# EAGLE design PAMonitorAP2 (EAGLE 7.5.0)
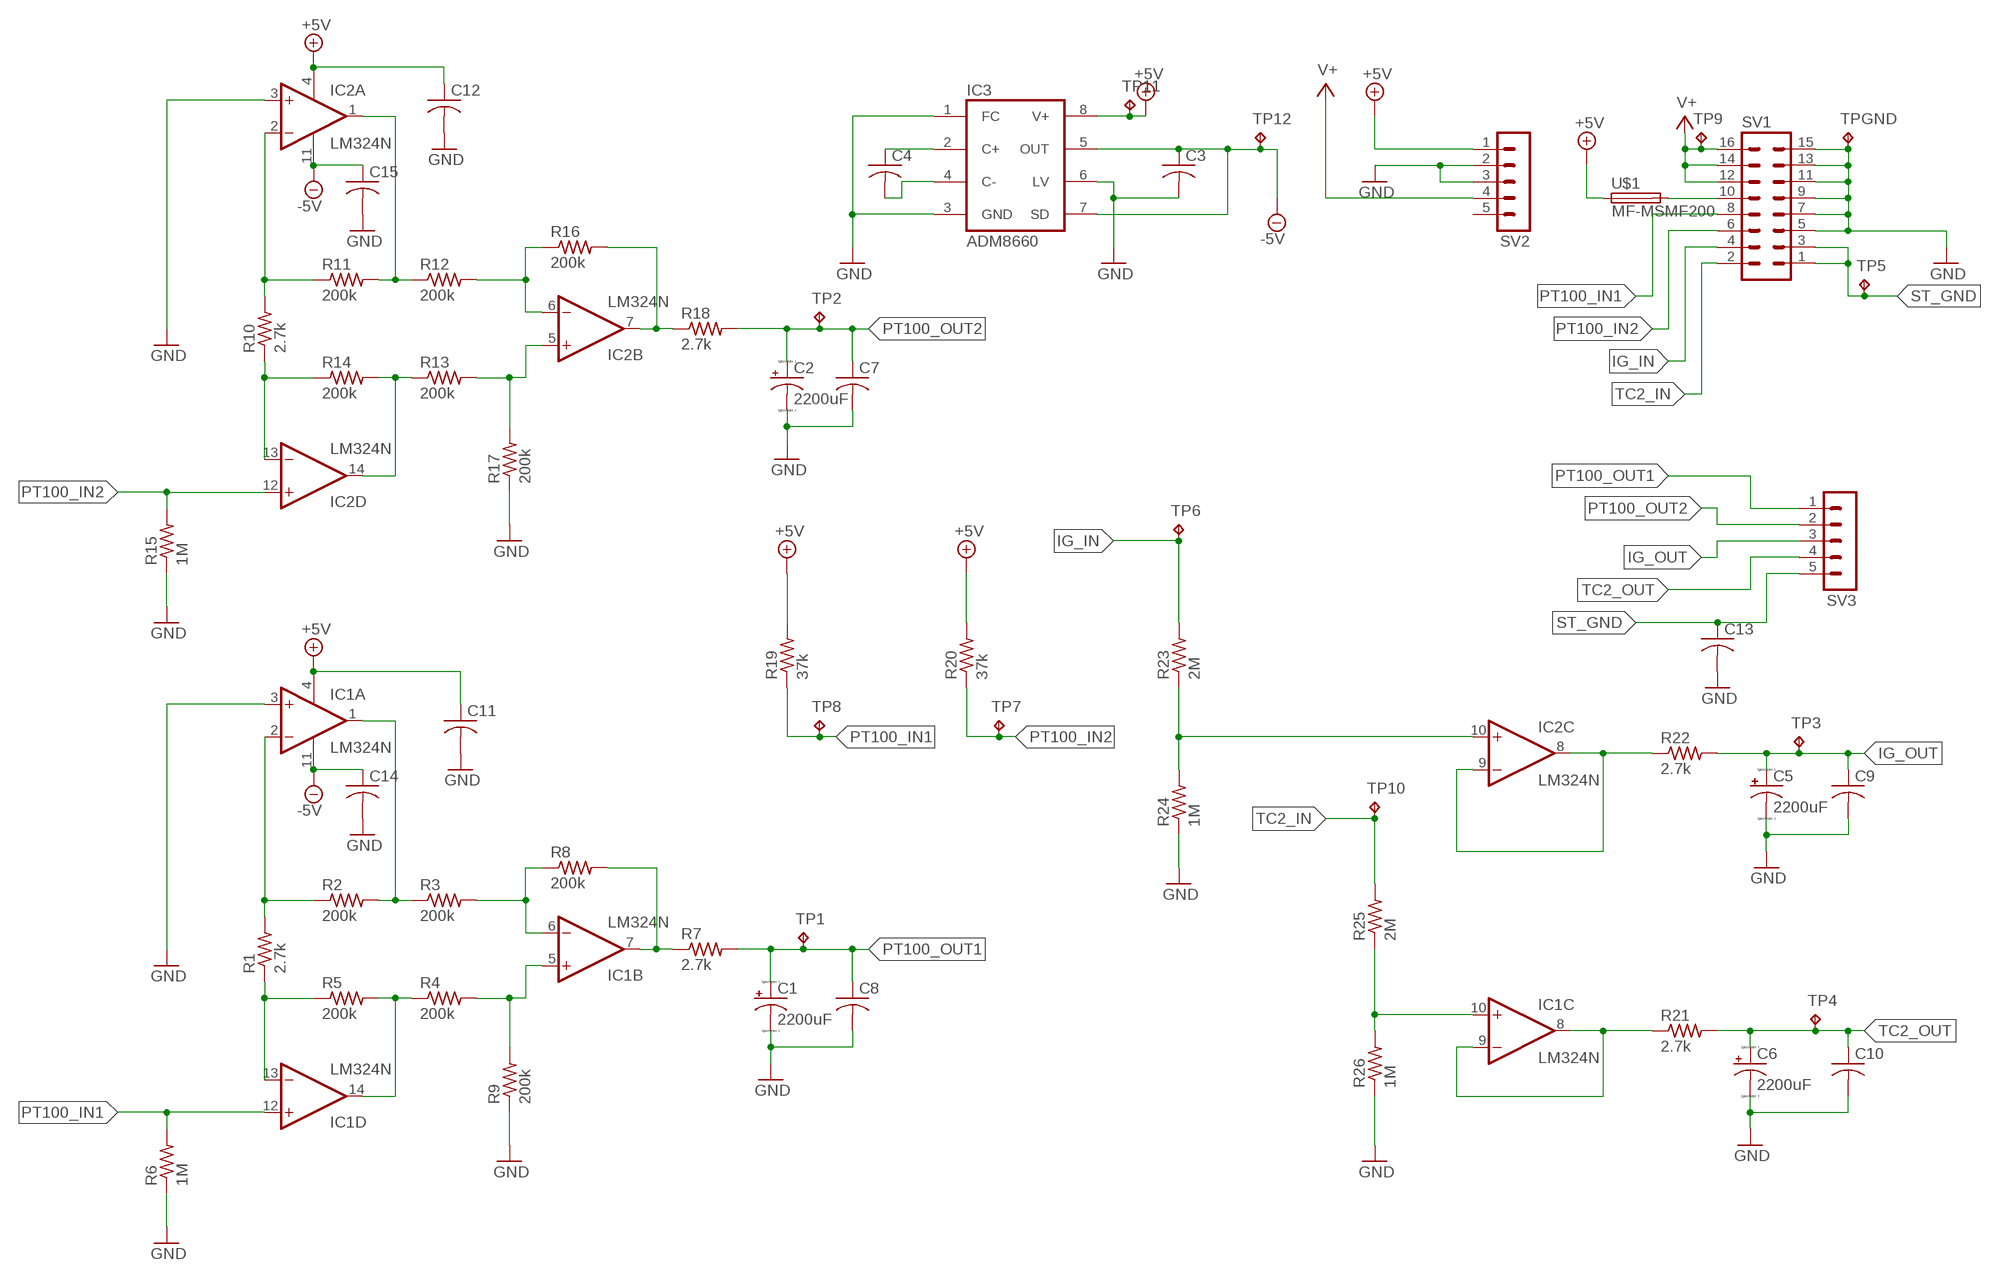
[diagram p0: schematic, sheet 1]

## Parts
C1  2200uF  CPOL-USE5-10.5  [E5-10,5]
C2  2200uF  CPOL-USE5-10.5  [E5-10,5]
C3  C-US025-025X050  [C025-025X050]
C4  C-US025-025X050  [C025-025X050]
C5  2200uF  CPOL-USE5-10.5  [E5-10,5]
C6  2200uF  CPOL-USE5-10.5  [E5-10,5]
C7  C-US025-025X050  [C025-025X050]
C8  C-US025-025X050  [C025-025X050]
C9  C-US025-025X050  [C025-025X050]
C10  C-US025-025X050  [C025-025X050]
C11  C-US025-025X050  [C025-025X050]
C12  C-US025-025X050  [C025-025X050]
C13  C-US025-025X050  [C025-025X050]
C14  C-US025-025X050  [C025-025X050]
C15  C-US025-025X050  [C025-025X050]
IC1  LM324N  [DIL14]
IC2  LM324N  [DIL14]
IC3  ADM8660  [ADM8660-DIL08]
R1  2.7k  R-US_0309/12  [0309/12]
R2  200k  R-US_0309/12  [0309/12]
R3  200k  R-US_0309/12  [0309/12]
R4  200k  R-US_0309/12  [0309/12]
R5  200k  R-US_0309/12  [0309/12]
R6  1M  R-US_0309/12  [0309/12]
R7  2.7k  R-US_0309/12  [0309/12]
R8  200k  R-US_0309/12  [0309/12]
R9  200k  R-US_0309/12  [0309/12]
R10  2.7k  R-US_0309/12  [0309/12]
R11  200k  R-US_0309/12  [0309/12]
R12  200k  R-US_0309/12  [0309/12]
R13  200k  R-US_0309/12  [0309/12]
R14  200k  R-US_0309/12  [0309/12]
R15  1M  R-US_0309/12  [0309/12]
R16  200k  R-US_0309/12  [0309/12]
R17  200k  R-US_0309/12  [0309/12]
R18  2.7k  R-US_0309/12  [0309/12]
R19  37k  R-US_0309/12  [0309/12]
R20  37k  R-US_0309/12  [0309/12]
R21  2.7k  R-US_0309/12  [0309/12]
R22  2.7k  R-US_0309/12  [0309/12]
R23  2M  R-US_0309/12  [0309/12]
R24  1M  R-US_0309/12  [0309/12]
R25  2M  R-US_0309/12  [0309/12]
R26  1M  R-US_0309/12  [0309/12]
SV1  MA08-2  [MA08-2]
SV2  MA05-1  [MA05-1]
SV3  MA05-1  [MA05-1]
TP1  TPB2,54  [B2,54]
TP2  TPB2,54  [B2,54]
TP3  TPB2,54  [B2,54]
TP4  TPB2,54  [B2,54]
TP5  TPB2,54  [B2,54]
TP6  TPB2,54  [B2,54]
TP7  TPB2,54  [B2,54]
TP8  TPB2,54  [B2,54]
TP9  TPB2,54  [B2,54]
TP10  TPB2,54  [B2,54]
TP11  TPB2,54  [B2,54]
TP12  TPB2,54  [B2,54]
TPGND  TPB2,54  [B2,54]
U$1  MF-MSMF200  MF-MSMF050  [MF-MSMF200]

## Nets
+5V: C11.1 C12.1 IC1.4(P:V+) IC2.4(P:V+) IC3.8(V+) R19.2 R20.2 SV2.1 TP11.TP U$1.1
-5V: C3.1 C14.1 C15.1 IC1.11(P:V-) IC2.11(P:V-) IC3.5(OUT) IC3.7(SD) TP12.TP
GND: C1.- C2.- C3.2 C5.- C6.- C7.2 C8.2 C9.2 C10.2 C11.2 C12.2 C13.2 C14.2 C15.2 IC1.3(A:+IN) IC2.3(A:+IN) IC3.1(FC) IC3.3(GND) IC3.6(LV) R6.1 R9.1 R15.1 R17.1 R24.1 R26.1 SV1.5 SV1.7 SV1.9 SV1.11 SV1.13 SV1.15 SV2.2 SV2.3 TPGND.TP
IG_IN: R23.2 SV1.4 TP6.TP
IG_OUT: C5.+ C9.1 R22.2 SV3.3 TP3.TP
N$1: IC1.13(D:-IN) R1.1 R5.1
N$2: IC1.2(A:-IN) R1.2 R2.1
N$3: IC1.1(A:OUT) R2.2 R3.1
N$4: IC1.6(B:-IN) R3.2 R8.1
N$5: IC1.5(B:+IN) R4.2 R9.2
N$6: IC1.14(D:OUT) R4.1 R5.2
N$7: IC1.7(B:OUT) R7.1 R8.2
N$8: IC2.13(D:-IN) R10.1 R14.1
N$9: IC2.2(A:-IN) R10.2 R11.1
N$10: IC2.1(A:OUT) R11.2 R12.1
N$11: IC2.6(B:-IN) R12.2 R16.1
N$12: IC2.5(B:+IN) R13.2 R17.2
N$13: IC2.14(D:OUT) R13.1 R14.2
N$14: IC2.7(B:OUT) R16.2 R18.1
N$15: C4.1 IC3.2(C+)
N$16: C4.2 IC3.4(C-)
N$17: SV1.10 U$1.2
N$18: IC2.8(C:OUT) IC2.9(C:-IN) R22.1
N$19: IC1.8(C:OUT) IC1.9(C:-IN) R21.1
N$20: IC1.10(C:+IN) R25.1 R26.2
N$21: IC2.10(C:+IN) R23.1 R24.2
PT100_IN1: IC1.12(D:+IN) R6.2 R19.1 SV1.8 TP8.TP
PT100_IN2: IC2.12(D:+IN) R15.2 R20.1 SV1.6 TP7.TP
PT100_OUT1: C1.+ C8.1 R7.2 SV3.1 TP1.TP
PT100_OUT2: C2.+ C7.1 R18.2 SV3.2 TP2.TP
ST_GND: C13.1 SV1.1 SV1.3 SV3.5 TP5.TP
TC2_IN: R25.2 SV1.2 TP10.TP
TC2_OUT: C6.+ C10.1 R21.2 SV3.4 TP4.TP
V+: SV1.12 SV1.14 SV1.16 SV2.4 TP9.TP
Unconnected: SV2.5

## Library data of the parts
C1 C2 C5 C6 = resistor:CPOL-US: POLARIZED CAPACITOR, American symbol
C3 C4 C7-C15 = rcl:C-US: CAPACITOR, American symbol
IC1 IC2 = linear:LM324: OP AMP
IC3 = my-comps:ADM8660: Charge-pump VOLTAGE CONVERTER; MF: Analog Devices; MPN: ADM8660
R1-R26 = resistor:R-US_: RESISTOR, American symbol
SV1 = con-lstb:MA08-2: PIN HEADER; OC_FARNELL: unknown; OC_NEWARK: unknown
SV2 SV3 = con-lstb:MA05-1: PIN HEADER; OC_FARNELL: unknown; OC_NEWARK: unknown
TP1-TP12 TPGND = testpad:TP: Test pad
U$1 = my-comps:MF-MSMF: MF-MSMF Series - PTC Resettable Fuses

## Board
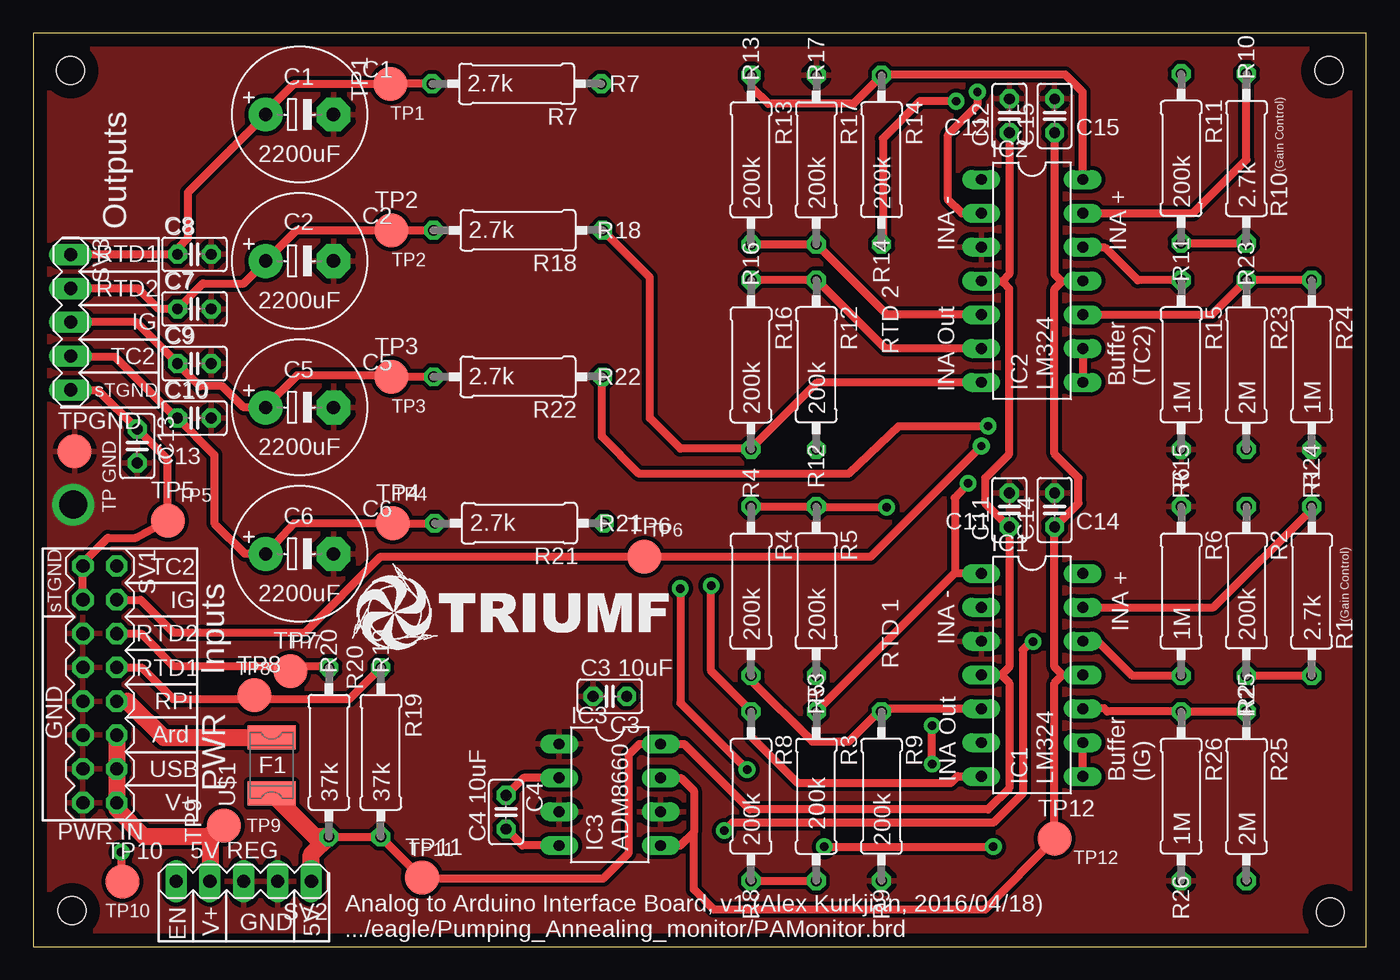
[diagram p1: board, top side]
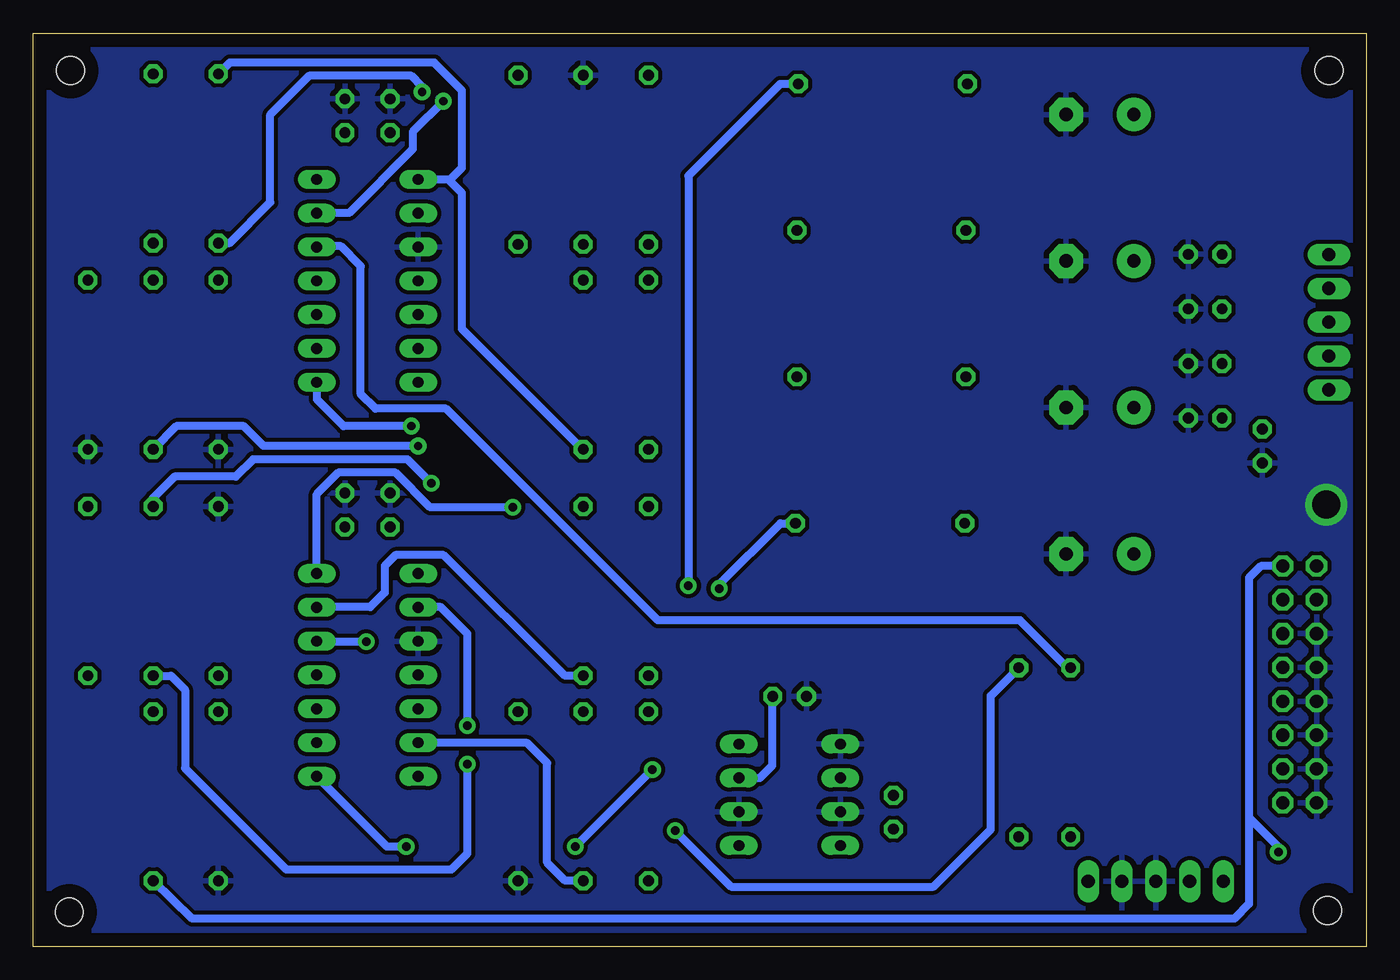
[diagram p2: board, bottom side, seen from below]

Size 100.1 x 68.6 mm. Coordinates in mm from the lower left corner, seen from the top.
Outline: 0,0 100.1,0 100.1,68.6 0,68.6 0,0
Copper layers (1*16): Top 0.035mm / dielectric 1.5mm / Bottom 0.035mm
Design rules "default *": minimum track width 24mil, minimum drill 25mil, track to track 12mil, track to pad 12mil, pad to pad 12mil, via to via 12mil, smd to smd 12mil, copper to edge 40mil, drill to drill 16mil, minimum pad ring 12mil, minimum via ring 12mil, stop-mask expansion 4mil, vias tented up to drill 10mil, thermal gap 16mil
Holes 2.11 mm at 2.9,2.7 97.4,2.6 97.3,65.8 2.8,65.8

### Footprints (pad centres in the part's own frame; a part is rotated, then mirrored left to right if it is on the bottom)
E5-10,5 = drill 0.991 pad 2.54: + -2.54,0 | drill 0.991 pad 2.54 octagon: - 2.54,0
C025-025X050 = drill 0.813 octagon: 1 -1.27,0; 2 1.27,0
DIL14 = drill 0.813 long: 1 -7.62,-3.81; 2 -5.08,-3.81; 3 -2.54,-3.81; 4 0,-3.81; 5 2.54,-3.81; 6 5.08,-3.81; 7 7.62,-3.81; 8 7.62,3.81; 9 5.08,3.81; 10 2.54,3.81; 11 0,3.81; 12 -2.54,3.81; 13 -5.08,3.81; 14 -7.62,3.81
ADM8660-DIL08 = drill 0.813 long: 1 -3.81,-3.81; 2 -1.27,-3.81; 3 1.27,-3.81; 4 3.81,-3.81; 5 3.81,3.81; 6 1.27,3.81; 7 -1.27,3.81; 8 -3.81,3.81
0309/12 = drill 0.813 octagon: 1 -6.35,0; 2 6.35,0
MA08-2 = drill 0.991 octagon: 1 -8.89,-1.27; 2 -8.89,1.27; 3 -6.35,-1.27; 4 -6.35,1.27; 5 -3.81,-1.27; 6 -3.81,1.27; 7 -1.27,-1.27; 8 -1.27,1.27; 9 1.27,-1.27; 10 1.27,1.27; 11 3.81,-1.27; 12 3.81,1.27; 13 6.35,-1.27; 14 6.35,1.27; 15 8.89,-1.27; 16 8.89,1.27
MA05-1 = drill 0.991 long: 1 -5.08,0; 2 -2.54,0; 3 0,0; 4 2.54,0; 5 5.08,0
B2,54 = smd 2.54 x 2.54: TP 0,0
MF-MSMF200 = smd 1.8 x 3.6: 1 -2.1,0; 2 2.1,0

### Placement (x,y rotation side)
C1  20,62.5 0 top
C2  20,51.5 0 top
C3  43.3,18.8 180 top
C4  35.5,10.1 270 top
C5  20,40.5 0 top
C6  20,29.5 0 top
C7  12.1,47.9 0 top
C8  12.1,52 0 top
C9  12.1,43.8 0 top
C10  12.1,39.7 0 top
C11  73.3,32.8 90 top
C12  73.3,62.4 90 top
C13  7.8,37.6 270 top
C14  76.7,32.8 90 top
C15  76.7,62.4 90 top
IC1  75,20.4 270 top
IC2  75,50 270 top
IC3  43.3,11.4 270 top
R1  96,26.7 270 top
R2  91.1,26.7 90 top
R3  58.8,11.3 270 top
R4  53.9,26.7 270 top
R5  58.8,26.7 90 top
R6  86.2,26.7 270 top
R7  36.3,64.8 180 top
R8  53.9,11.3 90 top
R9  63.7,11.3 90 top
R10  91.1,59.2 270 top
R11  86.2,59.2 90 top
R12  58.8,43.7 90 top
R13  53.9,59.1 270 top
R14  63.7,59.1 90 top
R15  86.2,43.7 90 top
R16  53.9,43.7 270 top
R17  58.8,59.1 270 top
R18  36.4,53.8 180 top
R19  26.1,14.6 270 top
R20  22.2,14.6 270 top
R21  36.5,31.8 180 top
R22  36.4,42.8 180 top
R23  91.1,43.7 270 top
R24  96,43.7 90 top
R25  91.1,11.3 270 top
R26  86.2,11.3 90 top
SV1  5,19.7 270 top
SV2  15.8,4.9 180 top
SV3  2.8,46.9 270 top
TP1  26.8,64.8 90 top
TP2  26.9,53.8 0 top
TP3  26.9,42.8 0 top
TP4  27,31.8 0 top
TP5  10.1,32 0 top
TP6  45.9,29.3 0 top
TP7  19.3,20.7 0 top
TP8  16.6,18.9 0 top
TP9  14.3,9.1 90 top
TP10  6.7,4.9 0 top
TP11  29.2,5.2 0 top
TP12  76.7,8.1 0 top
TPGND  3.1,37.2 0 top
U$1  17.9,13.6 90 top

### Tracks (layer width: path | path; a pad name or v marks a point on that pad's centre or on a via)
+5V
  Top 0.61: R20.2 R19.2 29.25,5.1 | IC3.8 48.9,15.2 53.8,10.3 71.7,10.3 73.3,11.9 73.3,19.8 72.7,20.4 | IC3.8 | IC3.8 45.5,15.2 44.7,14.4 44.7,7 42.8,5.1 29.25,5.1 | C11.1 73.3,21 72.7,20.4 | C12.1 73.3,50.5 72.8,50 | IC2.4 72.8,50 | 72.8,50 72.8,49.9 73.3,49.4 73.3,37 71.5,35.2 71.5,33.3 73.27,31.53 C11.1 | IC1.4 72.7,20.4 | 73.3,31.47 C11.1 | 29.25,5.1 29.25,5.15 TP11.TP
  Top 1.27: SV2.1 20.88,6.93 R20.2 21.15,8.25 U$1.1
-5V
  Top 0.61: IC3.7 48.63,12.67 49.6,11.7 49.6,8.6 | 49.6,8.6 48.6,7.6 IC3.5 | 49.6,8.6 49.6,4.3 51.1,2.8 71.5,2.8 TP12.TP 76.7,19.8 77.3,20.4 | 77.3,20.4 76.7,21 C14.1 76.73,31.53 78.5,33.3 78.5,35.2 76.7,37 76.7,49.4 77.2,49.9 77.2,50 | 77.3,20.4 IC1.11 | 77.2,50 76.7,50.5 C15.1 | 77.2,50 IC2.11
  Bottom 0.61: IC3.7 45.53,12.67 44.6,13.6 44.6,18.77 C3.1
GND  (via drill 2.11 pad 2.11)
  other vias: 3,33.2
  pour Bottom: -0.6,71.7 102.2,71.7 102.2,-1.1 -0.6,-1.1
  pour Top: -2.5,72.6 105.9,72.6 105.9,-2.8 -2.5,-2.8
IG_IN  (via drill 0.64 pad 0.64)
  Top 0.61: SV1.4 8.05,26.05 10.5,23.6 20.4,23.6 26.1,29.3 TP6.TP | TP6.TP 62.9,29.3 v71.2,37.6 | TP6.TP 62.9,29.3 63.15,29.55
  Bottom 0.61: v71.2,37.6 82.8,37.6 84.3,39.1 89.35,39.1 R23.2
IG_OUT
  Top 0.61: R22.2 TP3.TP 26.8,42.9 19.8,42.9 17.46,40.56 | 17.46,40.56 C5.+ | 17.46,40.56 17.4,40.5 15.8,40.5 14.2,42.1 12.5,42.1 10.83,43.77 C9.1 7.73,46.9 SV3.3
N$1
  Top 0.61: IC1.13 88.63,25.48 96,32.85 R1.1
  Bottom 0.61: R5.1 60.15,20.35 69.3,29.4 72.9,29.4 73.7,28.6 73.7,26.6 74.8,25.5 78.79,25.5 IC1.13
N$2  (via drill 0.64 pad 0.64)
  Top 0.61: R1.2 R2.1 | v67.5,13.7 v67.5,16.6
  Bottom 0.61: R2.1 89.75,20.35 88.7,19.3 88.7,13.4 81.1,5.8 68.7,5.8 67.5,7 v67.5,13.7 | v67.5,16.6 67.5,23.5 69.5,25.5 71.17,25.5 IC1.2
N$3  (via drill 0.64 pad 0.64)
  Top 0.61: 69.17,28.02 IC1.1 | 69.17,28.02 R3.1 | v70.2,34.8 69.2,33.7 69.2,28.05 69.17,28.02
  Bottom 0.61: R2.2 91.1,33.7 89.5,35.3 84.9,35.3 83.6,36.6 72,36.6 v70.2,34.8
N$4
  Top 0.61: R8.1 R3.2
  Bottom 0.61: R3.2 60.15,4.95 61.5,6.3 61.5,13.8 63,15.3 71.17,15.3 IC1.6
N$5
  Top 0.61: R4.2 53.9,20 58.5,15.4 61.25,15.4 63.5,17.65 R9.2 63.7,17.86 IC1.5
N$6  (via drill 0.64 pad 0.64)
  Top 0.61: R4.1 R5.2 58.85,33 v64.1,33
  Bottom 0.61: v64.1,33 70.3,33 72.9,35.6 77.2,35.6 78.81,33.99 IC1.14
N$7  (via drill 0.64 pad 0.64)
  Top 0.61: v50.9,27.1 50.9,20.7 53.9,17.7 R8.2 53.9,15.8 57.4,12.3 68.9,12.3 69.4,12.8 71.17,12.8 IC1.7
  Bottom 0.61: v50.9,27.1 50.9,57.9 44,64.8 R7.1
N$8  (via drill 0.64 pad 0.64)
  Top 0.61: IC2.13 87.08,55.08 91.1,59.1 R10.1 | v69.3,63.5 66.6,63.5 63.8,60.7 63.8,52.85 R14.1
  Bottom 0.61: IC2.13 78.22,55.08 78.2,55.1 76.4,55.1 71.6,59.9 71.6,61.2 v69.3,63.5 | v69.3,63.5 69.6,63.7 69.5,63.7 v69.3,63.5
N$9  (via drill 0.64 pad 0.64)
  Top 0.61: R11.1 R10.2 | IC2.2 69.72,55.08 68.7,56.1 68.7,61 70.9,63.2 v70.9,64.2
  Bottom 0.61: R11.1 85.35,52.85 82.3,55.9 82.3,62.5 79.4,65.4 71.7,65.4 70.9,64.6 v70.9,64.2
N$10
  Bottom 0.61: R12.1 58.85,37.35 67.9,46.4 67.9,56.6 68.9,57.6 | 68.9,57.6 71.17,57.6 IC2.1 | 68.9,57.6 68.8,57.6 67.9,58.5 67.9,64.3 70,66.4 85.35,66.4 R11.2
N$11
  Top 0.61: R16.1 R12.2 58.85,50.05 63.98,44.92 IC2.6
N$12
  Top 0.61: R13.2 R17.2 64.09,47.46 IC2.5
N$13
  Top 0.61: R13.1 53.9,64.6 55.2,63.3 61.6,63.3 63.7,65.4 R14.2 63.75,65.5 77.5,65.5 78.81,64.19 IC2.14
N$14
  Top 0.61: R16.2 53.9,37.4 | IC2.7 71.17,42.4 58.9,42.4 53.9,37.4 | 53.9,37.4 48.6,37.4 46.3,39.7 46.3,50.25 R18.1
N$15
  Top 0.61: IC3.2 36.8,12.67 C4.1
N$16
  Top 0.61: IC3.4 36.74,7.59 C4.2
N$17
  Top 1.27: SV1.10 7.07,18.43 9.8,15.7 U$1.2
N$18  (via drill 0.64 pad 0.64)
  Top 0.61: IC2.9 IC2.8 | v71.7,39.1 65,39.1 61.2,35.5 45.5,35.5 42.7,38.3 42.7,42.75 R22.1
  Bottom 0.61: v71.7,39.1 76.8,39.1 78.8,41.1 IC2.8
N$19  (via drill 0.64 pad 0.61, 0.64 pad 0.64)
  Top 0.61: IC1.8 IC1.9 | v48.6,26.9 48.6,18.3 v53.6,13.3 | v59.4,7.5 v72.1,7.5
  Bottom 0.61: v53.6,13.3 v59.4,7.5 | v72.1,7.5 73.53,7.5 IC1.8 | v48.6,26.9 48.6,27.2 44,31.8 R21.1
N$20
  Top 0.61: IC1.10 78.85,17.9 80.4,17.9 80.65,17.65 R26.2 R25.1
N$21
  Top 0.61: R24.2 R23.1 88.51,47.46 IC2.10
PT100_IN1  (via drill 0.64 pad 0.64)
  Top 0.61: R6.2 82.55,20.35 80,22.9 78.85,22.9 IC1.12 | SV1.8 8.13,20.97 10.5,18.6 16.7,18.6 | 16.7,18.6 23.75,18.6 R19.1 | v75.1,22.9 74.9,22.9 74.3,22.3 74.3,11.5 72.1,9.3 52.5,9.3 v51.9,8.7 | TP8.TP 16.6,18.7 16.7,18.6
  Bottom 0.61: IC1.12 75.14,22.94 v75.1,22.9 | v51.9,8.7 47.7,4.5 32.5,4.5 28.2,8.8 28.2,18.85 R19.1
PT100_IN2
  Top 0.61: SV1.6 8.09,23.51 10.5,21.1 20,21.1 | 22.15,21 R20.1 22.05,21.1 20,21.1 | TP7.TP 19.6,20.7 20,21.1 | R15.2 82.95,50.05 80.5,52.5 78.85,52.5 IC2.12
  Bottom 0.61: R20.1 22.45,20.95 26,24.5 53.2,24.5 69.1,40.4 74.4,40.4 75.5,41.5 75.5,51.1 77,52.6 78.75,52.6 IC2.12
PT100_OUT1
  Top 0.61: R7.2 TP1.TP 19.6,64.8 17.46,62.66 C1.+ 11.6,56.64 11.6,53.2 10.83,52.43 C8.1 10.81,51.98 SV3.1
PT100_OUT2
  Top 0.61: R18.2 TP2.TP 19.76,53.8 C2.+ 17.46,51.46 15.8,49.8 12.73,49.8 C7.1 9.4,47.9 7.86,49.44 SV3.2
ST_GND
  Top 0.61: SV1.3 SV1.1 3.73,28.83 5.6,30.7 7.7,30.7 TP5.TP 10.1,36.57 C13.1 4.85,41.82 SV3.5
TC2_IN  (via drill 0.64 pad 0.64)
  Top 0.61: v6.6,7.1 6.6,5.9 7.5,5 TP10.TP
  Bottom 0.61: SV1.2 7.91,28.59 8.8,27.7 8.8,9.7 | 8.8,9.7 8.8,3.2 9.9,2.1 88.15,2.1 R25.2 | v6.6,7.1 6.6,7.5 8.8,9.7
TC2_OUT
  Top 0.61: R21.2 TP4.TP 19.56,31.8 C6.+ 15.9,29.5 13.6,31.8 13.6,36.93 C10.1 10.73,39.7 6.13,44.3 2.86,44.3 SV3.4
V+
  Top 0.61: SV1.16 6.27,10.43 | TP9.TP 13.9,8.2 13.3,7.6
  Top 1.27: SV1.12 SV1.14 SV1.16 | 6.27,10.43 6.27,10.33 8.3,8.3 13.1,8.3 TP9.TP | 13.3,7.6 13.3,4.94 SV2.4

### Text on the board
tPlace: C1 | 2.7k | TP1 | R7 | R13 | R17 | R14 | C12 | C15 | R11 | 2200uF | (Gain Control) | 200k | 200k | 200k | 200k | 2.7k | R10 | Outputs | C8 | C2 | 2.7k | INA - | INA + | RTD1 | TP2 | R18 | C7 | RTD2 | 2200uF | IG | C9 | R16 | R12 | RTD 2 | R15 | R23 | R24 | TC2 | C5 | 2.7k | sTGND | INA Out | IC2 / LM324 | Buffer / (TC2) | C10 | TP3 | R22 | 200k | 200k | 1M | 2M | 1M | C13 | 2200uF | TP5 | TP4 | TP GND | C6 | C11 | C14 | 2.7k | TP6 | R21 | R4 | R5 | INA + | R6 | R2 | TC2 | IG | 2200uF | sTGND | (Gain Control) | RTD2 | TP7 | 200k | 200k | INA - | 1M | 200k | 2.7k | R1 | RTD1 | Inputs | TP8 | C3 10uF | RTD 1 | R20 | RPi | GND | Ard | R19 | R8 | R3 | R9 | USB | F1 | INA Out | IC1 / LM324 | Buffer / (IG) | R26 | R25 | PWR | V+ | 37k | 37k | TP9 | 200k | PWR IN | C4 10uF | 200k | 200k | 1M | 2M | 5V REG | TP11 | IC3 / ADM8660 | TP12 | TP10 | EN | V+ | 5V | GND | Analog to Arduino Interface Board, v1 (Alex Kurkjian, 2016/04/18) / .../eagle/Pumping_Annealing_monitor/PAMonitor.brd